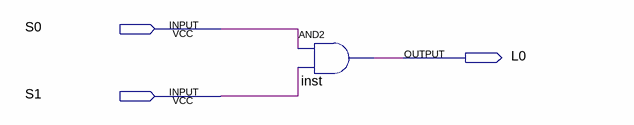
[diagram p0: schematic sheet]
// Quartus schematic exercise1.bdf as structural Verilog: 1 symbols, 3 pins
module exercise1 (
  input  S0,
  input  S1,
  output L0
);

  and inst (L0, S0, S1);
endmodule
